# EAGLE design SparkFun RTK Facet - Cellular-Dummy (EAGLE 9.6.2)

## Sheet 1 of 2
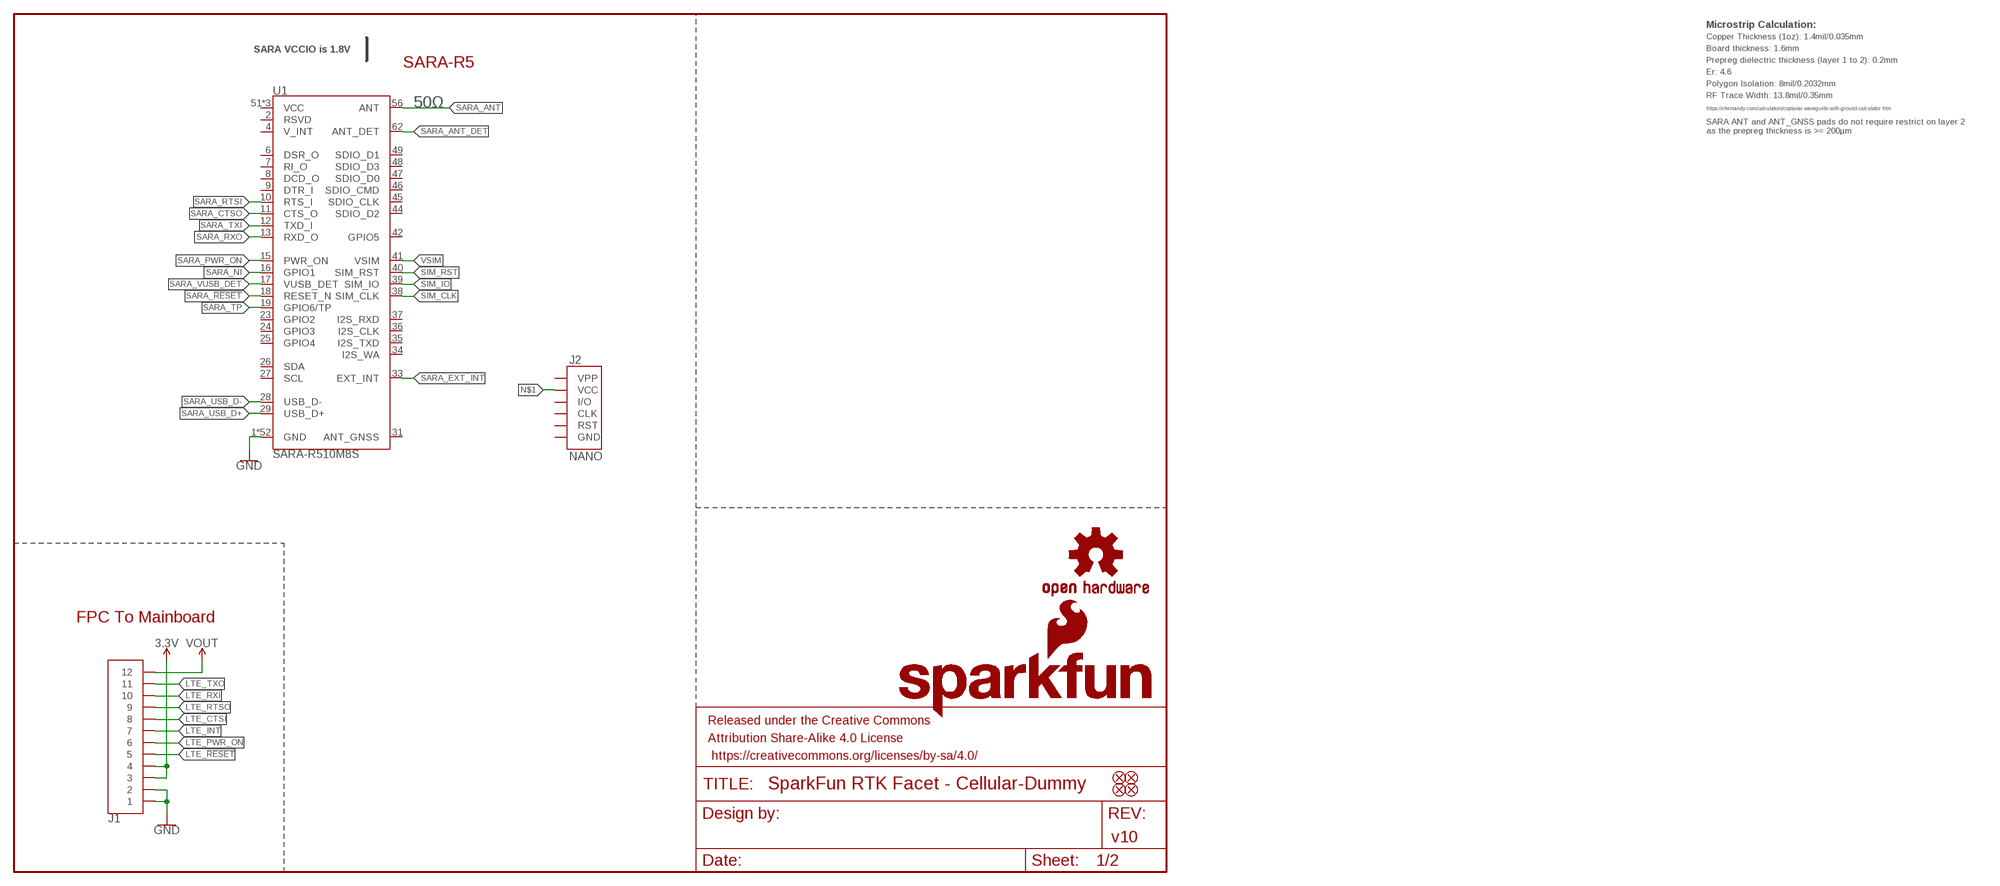
[diagram p0: schematic, sheet 1]

### Parts
FID1  FIDUCIAL1X2  [FIDUCIAL-1X2]
FID2  FIDUCIAL1X2  [FIDUCIAL-1X2]
FID3  FIDUCIAL1X2  [FIDUCIAL-1X2]
FID4  FIDUCIAL1X2  [FIDUCIAL-1X2]
FRAME1  FRAME-LETTER  [CREATIVE_COMMONS]
J1  FPC_12_0.5MM_BACKFLIP  [FPC_12_DOUBLESIDED_BACKFLIP]
J2  NANO  SIMHOLDER-PUSHPUSH  [NANO_SIM_PP]
LOGO3  OSHW-LOGOMINI  [OSHW-LOGO-MINI]
LOGO5  SFE_LOGO_NAME_FLAME.1_INCH  [SFE_LOGO_NAME_FLAME_.1]
U1  SARA-R510M8S  [SARA-LGA]

### Nets
3.3V [power]: J1.3 J1.4
GND: J1.1 J1.2 U1.1(GND) U1.3(GND) U1.5(GND) U1.14(GND) U1.20(GND) U1.21(GND) U1.22(GND) U1.30(GND) U1.32(GND) U1.43(GND) U1.50(GND) U1.54(GND) U1.55(GND) U1.57(GND) U1.58(GND) U1.59(GND) U1.60(GND) U1.61(GND) U1.63(GND) U1.64(GND) U1.65(GND) U1.66(GND) U1.67(GND) U1.68(GND) U1.69(GND) U1.70(GND) U1.71(GND) U1.72(GND) U1.73(GND) U1.74(GND) U1.75(GND) U1.76(GND) U1.77(GND) U1.78(GND) U1.79(GND) U1.80(GND) U1.81(GND) U1.82(GND) U1.83(GND) U1.84(GND) U1.85(GND) U1.86(GND) U1.87(GND) U1.88(GND) U1.89(GND) U1.90(GND) U1.91(GND) U1.92(GND) U1.93(GND) U1.94(GND) U1.95(GND) U1.96(GND)
LTE_!RESET!: J1.5
LTE_CTSI: J1.8
LTE_INT: J1.7
LTE_PWR_ON: J1.6
LTE_RTSO: J1.9
LTE_RXI: J1.10
LTE_TXO: J1.11
N$1: J2.C1(VCC)
SARA_!RESET!: U1.18(RESET_N)
SARA_ANT: U1.56(ANT)
SARA_ANT_DET: U1.62(ANT_DET)
SARA_CTSO: U1.11(CTS_O)
SARA_EXT_INT: U1.33(EXT_INT)
SARA_NI: U1.16(GPIO1)
SARA_PWR_ON: U1.15(PWR_ON)
SARA_RTSI: U1.10(RTS_I)
SARA_RXO: U1.13(RXD_O)
SARA_TP: U1.19(GPIO6/TP)
SARA_TXI: U1.12(TXD_I)
SARA_USB_D+: U1.29(USB_D+)
SARA_USB_D-: U1.28(USB_D-)
SARA_VUSB_DET: U1.17(VUSB_DET)
SIM_CLK: U1.38(SIM_CLK)
SIM_IO: U1.39(SIM_IO)
SIM_RST: U1.40(SIM_RST)
VOUT: J1.12
VSIM: U1.41(VSIM)
Unconnected: J2.C2(RST) J2.C3(CLK) J2.C6(VPP) J2.C7(I/O) U1.2(RSVD) U1.4(V_INT) U1.6(DSR_O) U1.7(RI_O) U1.8(DCD_O) U1.9(DTR_I) U1.23(GPIO2) U1.24(GPIO3) U1.25(GPIO4) U1.26(SDA) U1.27(SCL) U1.31(ANT_GNSS) U1.34(I2S_WA) U1.35(I2S_TXD) U1.36(I2S_CLK) U1.37(I2S_RXD) U1.42(GPIO5) U1.44(SDIO_D2) U1.45(SDIO_CLK) U1.46(SDIO_CMD) U1.47(SDIO_D0) U1.48(SDIO_D3) U1.49(SDIO_D1)

### Notes on the sheet
- Microstrip Calculation:
- Copper Thickness (1oz): 1.4mil/0.035mm
- SARA VCCIO is 1.8V
- Board thickness: 1.6mm
- SARA-R5 | Prepreg dielectric thickness (layer 1 to 2): 0.2mm
- Er: 4.6
- Polygon Isolation: 8mil/0.2032mm
- RF Trace Width: 13.8mil/0.35mm
- 50Ω
- https://chemandy.com/calculators/coplanar-waveguide-with-ground-calculator.htm
- SARA ANT and ANT_GNSS pads do not require restrict on layer 2
  as the prepreg thickness is >= 200µm
- FPC To Mainboard
- v10

## Sheet 2 of 2

## Power pins joined to a net without a drawn wire
GND: J2.C5(GND)
VCC: U1.51(VCC) U1.52(VCC) U1.53(VCC)

## Library data of the parts
FID1-FID4 = SparkFun-Aesthetics:FIDUCIAL: Fiducial Alignment Points Point-of-reference for pick-and-place machines and other optical instruments.
FRAME1 = SparkFun-Aesthetics:FRAME-LETTER: Schematic Frame - Letter Standard 8.5x11 US Letter frame
J1 = RTK Facet:FPC_12_0.5MM; PROD_ID: CONN-15766
J2 = SparkFun-Connectors:SIMHOLDER: SIM Cellular Card Socket SMT 6 pin standard connection. SparkFun Products: SIM Socket <https://www.sparkfun.com/products/548> SparkFun Cellular Shield - MG2639 <https://www.sparkfun.com/products/13120> SparkFun SIM Card Socket Breakout <https://www.sparkfun.com/products/573>
LOGO3 = SparkFun-Aesthetics:OSHW-LOGO: Open-Source Hardware (OSHW) Logo This logo indicates the piece of hardware it is found on incorporates a OSHW license and/or adheres to the definition of open source hardware found here: http://freedomdefined.org/OSHW
LOGO5 = SparkFun-Aesthetics:SFE_LOGO_NAME_FLAME: SparkFun Font Logo w/ Flame This is the SparkFun full logo. The logo on the schematic will always be the same size; the package variant is the height of the flame part of the logo. Default layer for the logo on the board is tSilk.
U1 = SARA_R5:SARA-R510M8S; PROD_ID: IC-15573

## Net classes
0 default: width 0 mm, drill 0 mm
1 power: width 0.178 mm

## Board
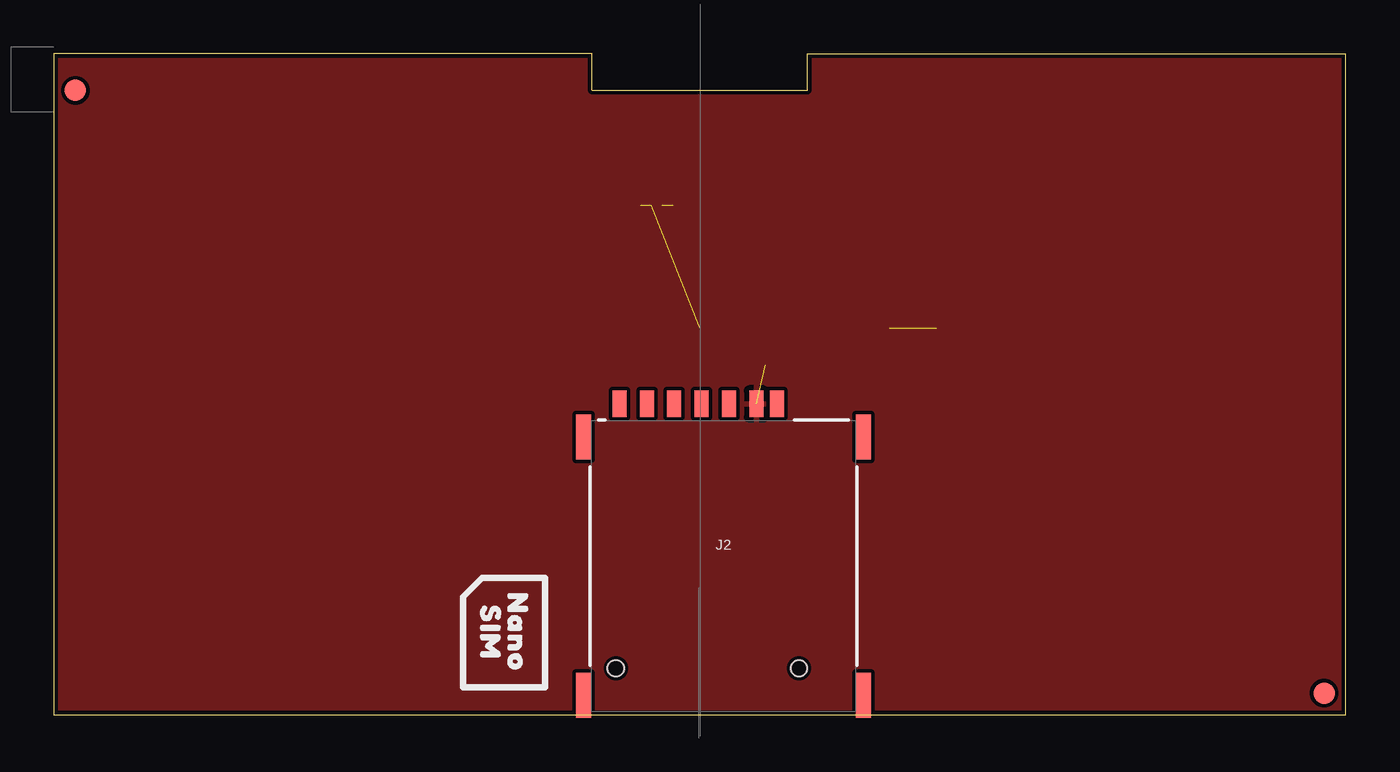
[diagram p1: board, top side]
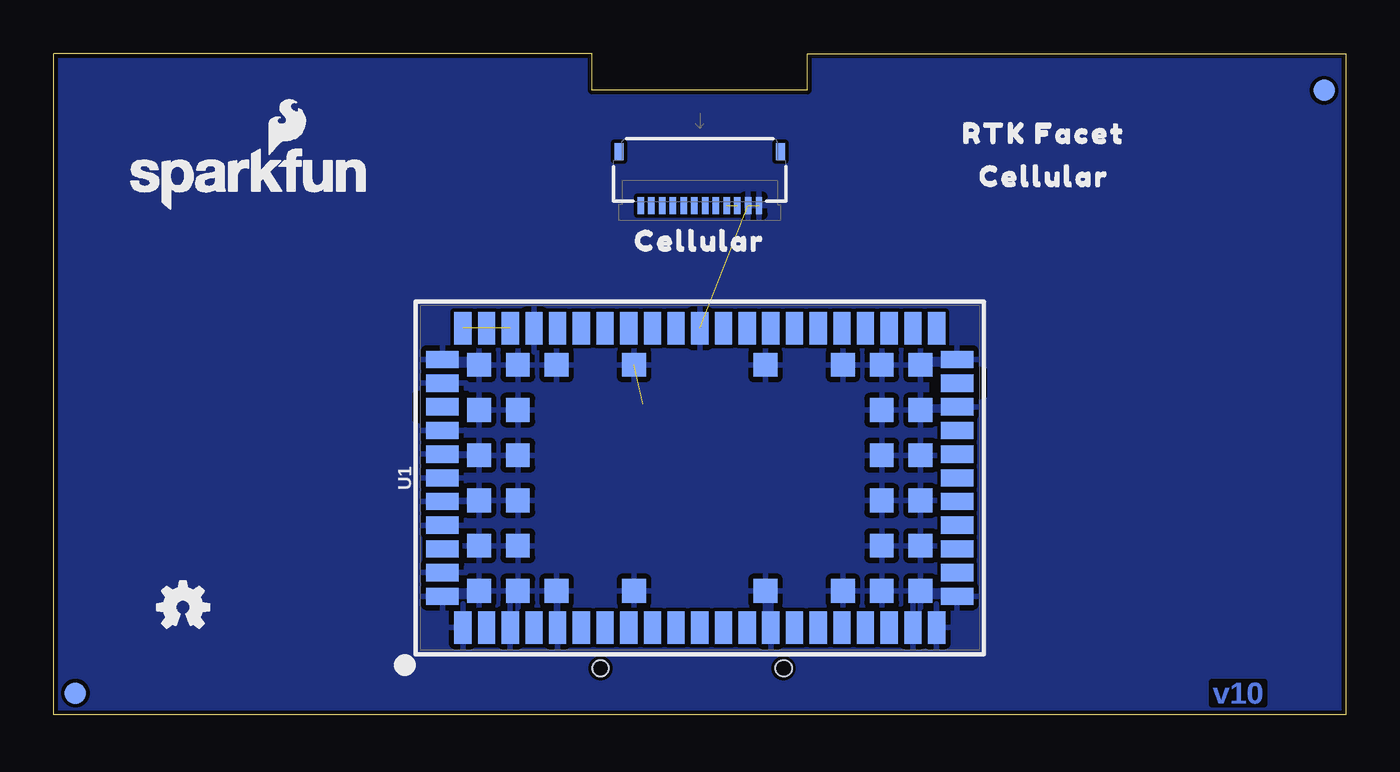
[diagram p2: board, bottom side, seen from below]

Size 60 x 30.7 mm. Coordinates in mm from the lower left corner, seen from the top.
Outline: 60,0 60,30.7 35,30.7 35,29 25,29 25,30.7 0,30.7 0,0 60,0
Copper layers (1*16): Top 0.035mm / dielectric 1.5mm / Bottom 0.035mm
Design rules "SparkFun-2-layer-TIGHT": minimum track width 7mil, minimum drill 15mil, track to track 7mil, track to pad 7mil, pad to pad 7mil, via to via 7mil, smd to smd 7mil, copper to edge 7mil, drill to drill 7mil, minimum pad ring 7mil, minimum via ring 7mil, stop-mask expansion 4mil, vias tented up to drill 25mil, thermal gap 10mil
tKeepout: area 0,0 to 3,31; area 57,0 to 60,32
bKeepout: area 0,0 to 3,31; area 57,0 to 60,32

### Footprints (pad centres in the part's own frame; a part is rotated, then mirrored left to right if it is on the bottom)
FIDUCIAL-1X2 = smd 1 x 1: 1 0,0
FPC_12_DOUBLESIDED_BACKFLIP = smd 0.3 x 0.8: 1 -2.75,1.35; 2 -2.25,1.35; 3 -1.75,1.35; 4 -1.25,1.35; 5 -0.75,1.35; 6 -0.25,1.35; 7 0.25,1.35; 8 0.75,1.35; 9 1.25,1.35; 10 1.75,1.35; 11 2.25,1.35; 12 2.75,1.35 | smd 0.4 x 0.8: MP1 -3.75,-1.15; MP2 3.75,-1.15
NANO_SIM_PP = smd 0.7 x 2.1: A1 6.495,6; A2 -6.495,6; A3 -6.495,-6; A4 6.495,-6 | smd 0.65 x 1.23: C1 0.255,7.535; C2 -2.285,7.535; C3 -4.825,7.535; C5 1.525,7.535; C6 -1.015,7.535; C7 -3.555,7.535; CD 2.475,7.535 | hole 0.75: 3.505,-4.75; -4.995,-4.75
SARA-LGA = smd 0.8 x 1.5: 1 -11,-6.95; 2 -9.9,-6.95; 3 -8.8,-6.95; 4 -7.7,-6.95; 5 -6.6,-6.95; 6 -5.5,-6.95; 7 -4.4,-6.95; 8 -3.3,-6.95; 9 -2.2,-6.95; 10 -1.1,-6.95; 11 0,-6.95; 12 1.1,-6.95; 13 2.2,-6.95; 14 3.3,-6.95; 15 4.4,-6.95; 16 5.5,-6.95; 17 6.6,-6.95; 18 7.7,-6.95; 19 8.8,-6.95; 20 9.9,-6.95; 21 11,-6.95; 33 11,6.95; 34 9.9,6.95; 35 8.8,6.95; 36 7.7,6.95; 37 6.6,6.95; 38 5.5,6.95; 39 4.4,6.95; 40 3.3,6.95; 41 2.2,6.95; 42 1.1,6.95; 43 0,6.95; 44 -1.1,6.95; 45 -2.2,6.95; 46 -3.3,6.95; 47 -4.4,6.95; 48 -5.5,6.95; 49 -6.6,6.95; 50 -7.7,6.95; 51 -8.8,6.95; 52 -9.9,6.95; 53 -11,6.95 | smd 1.5 x 0.8: 22 11.95,-5.5; 23 11.95,-4.4; 24 11.95,-3.3; 25 11.95,-2.2; 26 11.95,-1.1; 27 11.95,0; 28 11.95,1.1; 29 11.95,2.2; 30 11.95,3.3; 31 11.95,4.4; 32 11.95,5.5; 54 -11.95,5.5; 55 -11.95,4.4; 56 -11.95,3.3; 57 -11.95,2.2; 58 -11.95,1.1; 59 -11.95,0; 60 -11.95,-1.1; 61 -11.95,-2.2; 62 -11.95,-3.3; 63 -11.95,-4.4; 64 -11.95,-5.5 | smd 1.1 x 1.1: 65 -10.25,-5.25; 66 -10.25,-3.15; 67 -10.25,-1.05; 68 -10.25,1.05; 69 -10.25,3.15; 70 -10.25,5.25; 71 -8.45,-5.25; 72 -8.45,-3.15; 73 -8.45,-1.05; 74 -8.45,1.05; 75 -8.45,3.15; 76 -8.45,5.25; 77 -6.65,-5.25; 78 -6.65,5.25; 79 -3.05,-5.25; 80 -3.05,5.25; 81 3.05,-5.25; 82 3.05,5.25; 83 6.65,-5.25; 84 6.65,5.25; 85 8.45,-5.25; 86 8.45,-3.15; 87 8.45,-1.05; 88 8.45,1.05; 89 8.45,3.15; 90 8.45,5.25; 91 10.25,-5.25; 92 10.25,-3.15; 93 10.25,-1.05; 94 10.25,1.05; 95 10.25,3.15; 96 10.25,5.25

### Placement (x,y rotation side)
FID1  59,1 0 top
FID2  1,29 0 top
FID3  1,29 0 bottom
FID4  59,1 0 bottom
FRAME1  7.43,-29.5 0 top  (outside the outline)
J1  30,25 180 bottom
J2  31.1,6.9 0 top
LOGO3  54,5 0 bottom
LOGO5  50.9,24.9 0 bottom
U1  30,11 0 bottom
U$2  [CELLULAR1]  14,25 0 bottom
U$13  [CELLULAR0]  30,22 0 bottom
U$14  [RTK_FACET0]  14,27 0 bottom
U$130  [NANO0]  21.54,3.81 270 top
U$131  [SIM0]  20.27,3.81 270 top

### Tracks (layer width: path | path; a pad name or v marks a point on that pad's centre or on a via)
3.3V  (1 unrouted)
GND  (3 unrouted)
  pour Bottom (isolate 0.152): 60,0 60,30.7 0,30.7 0,0
  pour Top (isolate 0.152): 60,0 60,30.7 0,30.7 0,0
VCC  (2 unrouted)

### Text on the board
Bottom: v10
bDocu: FPC stiffener is 3mm